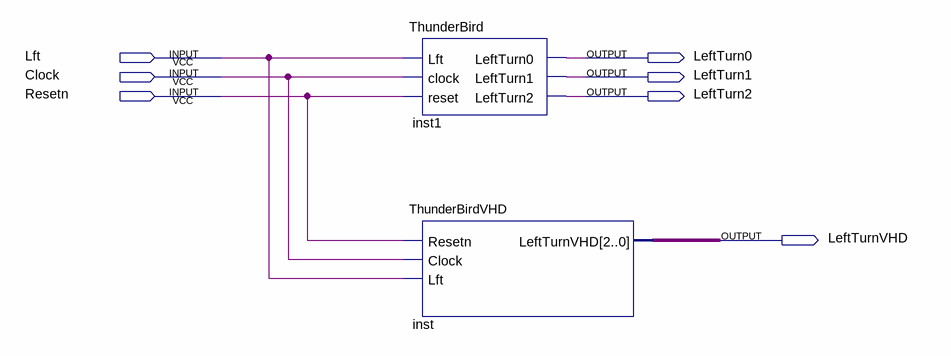
[diagram p0: schematic sheet]
// Quartus schematic Combined.bdf as structural Verilog: 2 symbols, 7 pins
module Combined (
  input  Lft,
  input  Clock,
  input  Resetn,
  output LeftTurn0,
  output LeftTurn1,
  output LeftTurn2,
  output LeftTurnVHD
);

  wire [2:0] inst_leftturnvhd;

  ThunderBird inst1 (
    .Lft(Lft), .clock(Clock), .reset(Resetn), .LeftTurn0(LeftTurn0), .LeftTurn1(LeftTurn1),
    .LeftTurn2(LeftTurn2));
  ThunderBirdVHD inst (.Resetn(Resetn), .Clock(Clock), .Lft(Lft), .LeftTurnVHD(inst_leftturnvhd));
endmodule
